# Altium schematic sheet mega nhakinh.SchDoc
size A1; SheetNumber: 1; SheetTotal: 1
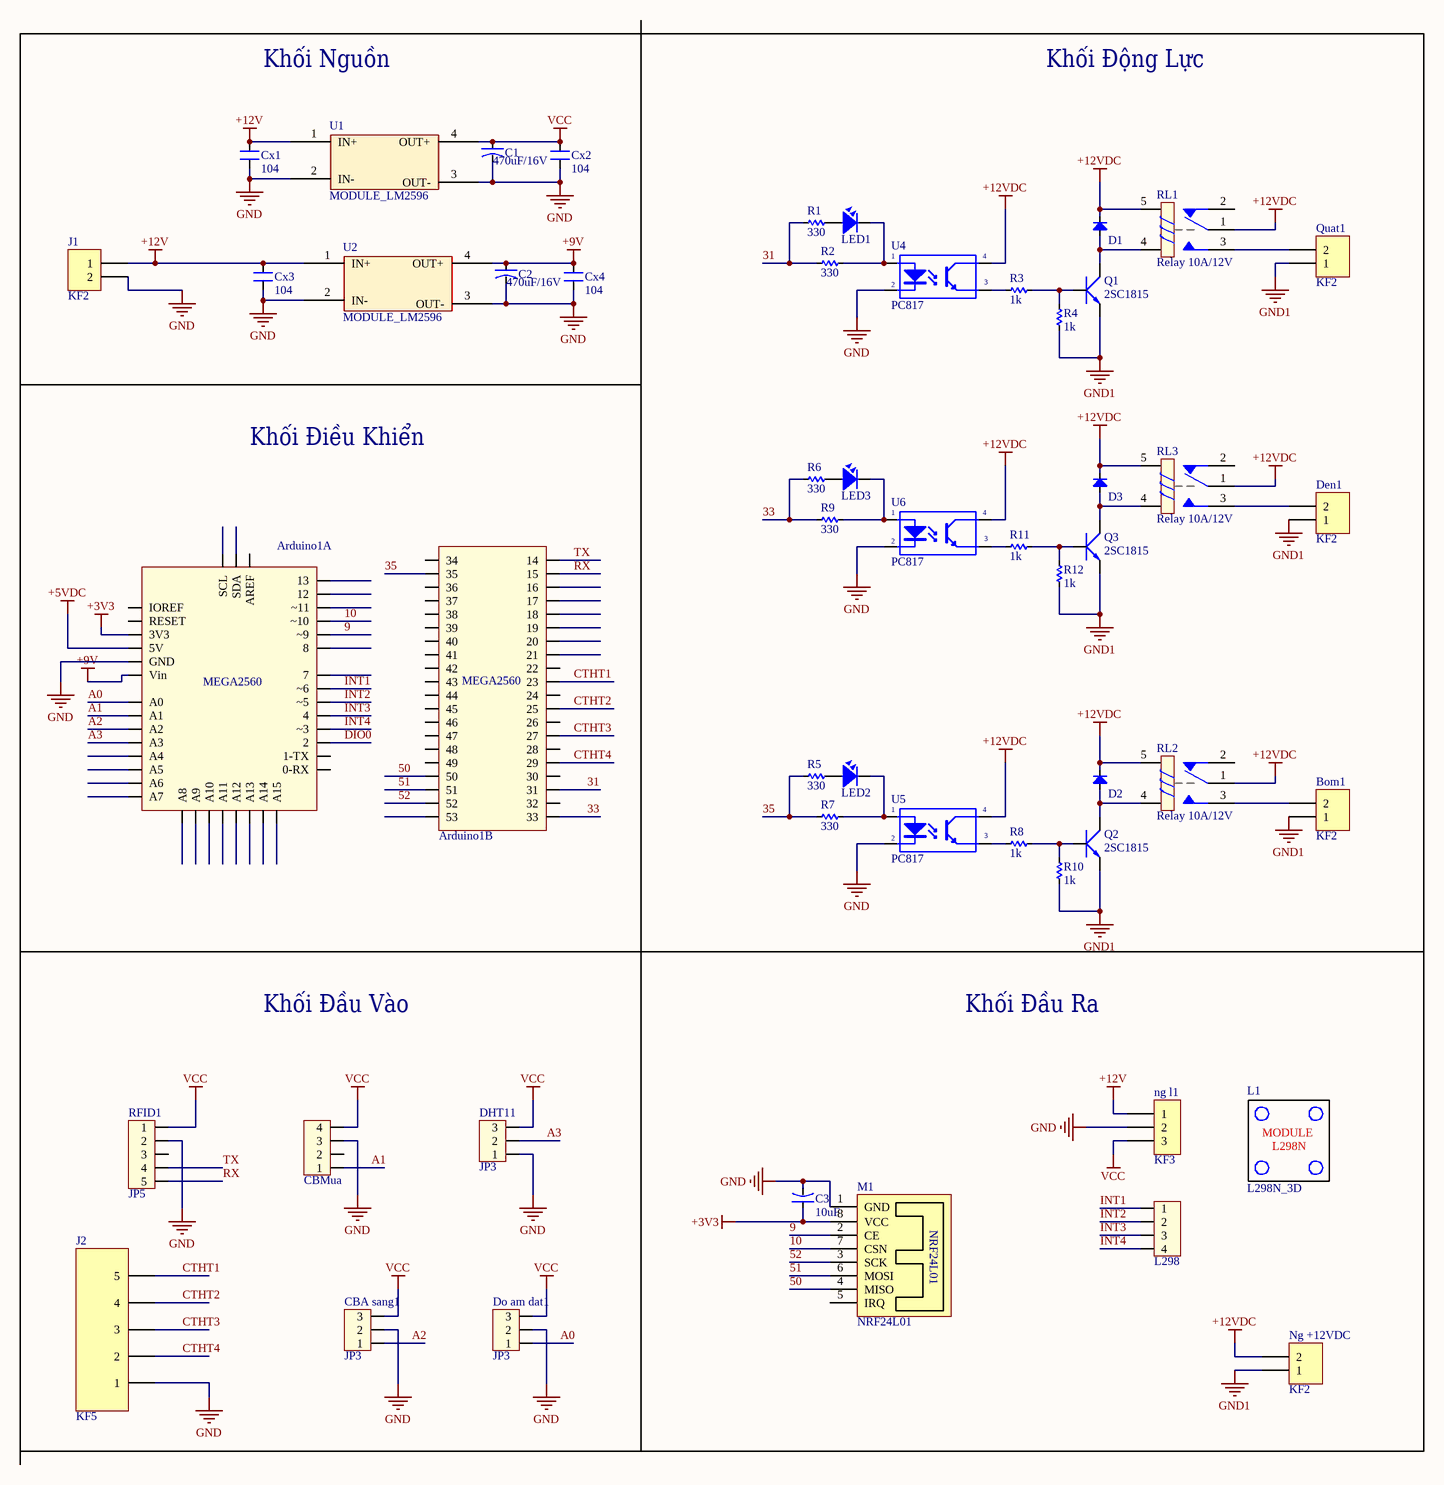
[diagram p0: mega nhakinh.SchDoc]

## Parts
Arduino1  Arduino Mega2560  [Arduino MEGA2560]  (value not drawn)  (parts A,B of 2)
Bom1  KF2  [KF2-5.08]
C1  470uF/16V  [CA-ALU-10R]
C2  470uF/16V  [CA-ALU-10R]
C3  10uF  [CA-ALU-6.3R]
CBA_sang1  JP3  [CON3]
Cx1  104  [CN2-T]
Cx2  104  [CN2-T]
Cx3  104  [CN2-T]
Cx4  104  [CN2-T]
D1  Diode  [DIO-1A-SMALL]  (value not drawn)
D2  Diode  [DIO-1A-SMALL]  (value not drawn)
D3  Diode  [DIO-1A-SMALL]  (value not drawn)
Den1  KF2  [KF2-5.08]
DHT11  JP3  [CON3]
Do_am_dat1  JP3  [CON3]
J1  KF2  [KF2-5.08]
J2  KF5  [KF5-5]
JP1  L298  [CON4]
JP2  CBMua  [CON4]
L1  L298N_3D  [L298N_3D]
LED1  LED  [LED-5MM-BLUE]  (value not drawn)
LED2  LED  [LED-5MM-BLUE]  (value not drawn)
LED3  LED  [LED-5MM-BLUE]  (value not drawn)
M1  NRF24L01  [NRF24L01]
Ng_+12VDC  KF2  [KF2-5.08]
ng_l1  KF3  [KF3-3.5]
Q1  2SC1815  [TO92-123]
Q2  2SC1815  [TO92-123]
Q3  2SC1815  [TO92-123]
Quat1  KF2  [KF2-5.08]
R1  330  [RES-1/4W-SMALL]
R2  330  [RES-1/4W-SMALL]
R3  1k  [RES-1/4W-SMALL]
R4  1k  [RES-1/4W-SMALL]
R5  330  [RES-1/4W-SMALL]
R6  330  [RES-1/4W-SMALL]
R7  330  [RES-1/4W-SMALL]
R8  1k  [RES-1/4W-SMALL]
R9  330  [RES-1/4W-SMALL]
R10  1k  [RES-1/4W-SMALL]
R11  1k  [RES-1/4W-SMALL]
R12  1k  [RES-1/4W-SMALL]
RFID1  JP5  [CON5]
RL1  Relay 10A/12V  [RELAY 5]
RL2  Relay 10A/12V  [RELAY 5]
RL3  Relay 10A/12V  [RELAY 5]
U1  MODULE_LM2596  [MODULE_LM2596]
U2  MODULE_LM2596  [MODULE_LM2596]
U4  PC817  [DIP4]
U5  PC817  [DIP4]
U6  PC817  [DIP4]

## Blocks framed on the sheet
Khối Nguồn: C1 C2 Cx1-Cx4 J1 U1 U2

## Nets
+3V3: Arduino1.3V3 C3.1 M1.8(VCC)
+5VDC: Arduino1.5V
+9V: Arduino1.Vin C2.1 Cx4.2 U2.4(OUT+)
+12V: Cx1.2 Cx3.2 J1.1 ng_l1.1 U1.1(IN+) U2.1(IN+)
+12VDC: D1.2(K) D2.2(K) D3.2(K) Ng_+12VDC.2 RL1.1 RL1.5 RL2.1 RL2.5 RL3.1 RL3.5 U4.4(C) U5.4(C) U6.4(C)
GND: Arduino1.GND C1.2 C2.2 C3.2 CBA_sang1.2 Cx1.1 Cx2.1 Cx3.1 Cx4.1 DHT11.1 Do_am_dat1.2 J1.2 J2.1 JP2.3 M1.1(GND) ng_l1.2 RFID1.2 U1.2(IN-) U1.3(OUT-) U2.2(IN-) U2.3(OUT-) U4.2(K) U5.2(K) U6.2(K)
GND1: Bom1.1 Den1.1 Ng_+12VDC.1 Q1.1(E) Q2.1(E) Q3.1(E) Quat1.1 R4.2 R10.2 R12.2
VCC: C1.1 CBA_sang1.3 Cx2.2 DHT11.3 Do_am_dat1.3 JP2.4 ng_l1.3 RFID1.1 U1.4(OUT+)
9: Arduino1.~9 M1.2(CE)
10: Arduino1.~10 M1.7(CSN)
31: Arduino1.31 R1.1 R2.1
33: Arduino1.33 R6.1 R9.1
35: Arduino1.35 R5.1 R7.1
50: Arduino1.50 M1.4(MISO)
51: Arduino1.51 M1.6(MOSI)
52: Arduino1.52 M1.3(SCK)
A0: Arduino1.A0 Do_am_dat1.1
A1: Arduino1.A1 JP2.1
A2: Arduino1.A2 CBA_sang1.1
A3: Arduino1.A3 DHT11.2
CTHT1: Arduino1.23 J2.5
CTHT2: Arduino1.25 J2.4
CTHT3: Arduino1.27 J2.3
CTHT4: Arduino1.29 J2.2
DIO0: Arduino1.2
INT1: Arduino1.~6 JP1.1
INT2: Arduino1.~5 JP1.2
INT3: Arduino1.4 JP1.3
INT4: Arduino1.~3 JP1.4
RX: Arduino1.15 RFID1.5
TX: Arduino1.14 RFID1.4
NetBom1_2: Bom1.2 RL2.3
NetD1_1: D1.1(A) Q1.2(C) RL1.4
NetD2_1: D2.1(A) Q2.2(C) RL2.4
NetD3_1: D3.1(A) Q3.2(C) RL3.4
NetDen1_2: Den1.2 RL3.3
NetLED1_1: LED1.1 R1.2
NetLED1_2: LED1.2 R2.2 U4.1(A)
NetLED2_1: LED2.1 R5.2
NetLED2_2: LED2.2 R7.2 U5.1(A)
NetLED3_1: LED3.1 R6.2
NetLED3_2: LED3.2 R9.2 U6.1(A)
NetQ1_3: Q1.3(B) R3.2 R4.1
NetQ2_3: Q2.3(B) R8.2 R10.1
NetQ3_3: Q3.3(B) R11.2 R12.1
NetQuat1_2: Quat1.2 RL1.3
NetR3_1: R3.1 U4.3(E)
NetR8_1: R8.1 U5.3(E)
NetR11_1: R11.1 U6.3(E)

Not connected (* = marked no-connect by the designer): Arduino1 0-RX 1-TX 7 8 12 13 16 17 18 19 20 21 22 24 26 28 30 32 34 36 37 38 39 40 41 42 43 44 45 46 47 48 49 53 A4 A5 A6 A7 A8 A9 A10 A11 A12 A13 A14 A15 AREF IOREF RESET SCL SDA ~11; JP2 2; M1 5(IRQ); RFID1 3; RL1 2; RL2 2; RL3 2

## Notes on the sheet
- Khối Động Lực
- Khối Điều Khiển
- Khối Đầu Vào
- Khối Đầu Ra
- (in symbol Arduino Mega2560, part A) MEGA2560
- (in symbol Arduino Mega2560, part B) MEGA2560
- (in symbol L298N_3D) MODULE; L298N

## Library data of the parts
Arduino1 = Arduino Mega2560: Value: Cau 1A
Bom1 Den1 J1 Ng_+12VDC Quat1 = KF2: Manufacturer: Würth Elektronik eiSos GmbH; partNo: 691103110002; ComponentLink1 Description: Manufacturer; ComponentLink2 Description: Datasheet; NoPins: 2; Created Date: 29 October 2013; ComponentLink1URL: http://www.we-online.com; ComponentLink2URL: http://katalog.we-online.de/em/datasheet/6911031100xx.pdf; Created by: Karrer Zheng
C1-C3 = CN-ALU-DIP: Capacitor (Semiconductor SIM Model); Value: 104; LatestRevisionDate: 17-Jul-2002; LatestRevisionNote: Re-released for DXP Platform.; PackageReference: C1206; Publisher: Altium Limited
CBA_sang1 DHT11 Do_am_dat1 = Con3: Connector 3; Value: Connector 3
Cx1-Cx4 = CN: Value: 33pF
D1-D3 = Diode: Default Diode; Code - JEDEC: DO-214-AB; Value: 1N5007; Published: 8-Jun-2000; Revision: July-2002: Re-released for DXP Platform.; Publisher: Altium Limited
J2 = KF5: Manufacturer: W¨¹rth Elektronik eiSos GmbH; PartNo: 691133710005; ComponentLink1 Description: Manufacturer; ComponentLink2 Description: Datasheet; NoPins: 5; ComponentLink1 URL: http://www.we-online.com; ComponentLink2 URL: http://katalog.we-online.de/em/datasheet/6911337100xx.pdf; Created By: Baojun Chen; Created Date: 4-Aug-15
JP1 JP2 = Con4: Connector 4; Value: Connector 4
LED1-LED3 = LED: LED Single colour Green and Red; Value: LED 3 ly Single Colour
ng_l1 = KF3: Manufacturer: Würth Elektronik eiSos GmbH; partNo: 691103110003; ComponentLink1 Description: Manufacturer; ComponentLink2 Description: Datasheet; NoPins: 3; Created Date: 29 October 2013; ComponentLink1URL: http://www.we-online.com; ComponentLink2URL: http://katalog.we-online.de/em/datasheet/6911031100xx.pdf; Created by: Karrer Zheng
Q1-Q3 = 2SC1815: NPN 600mW, ECB; Value: C1815
R1-R12 = Res: Manufacturer: Generic Components; Class: Passive; SubClass: R; Published: 08/06/2000; Publisher: Altium Hobart Technology Centre
RFID1 = Con5: Connector 5; Value: Connector 5
RL1-RL3 = Relay 5: Relay SPDT,10A - 12VDC 5 Pin; Value: Relay SPDT, 10A, 12V
U4-U6 = PC817: Single Opto; Value: PC817